# Altium schematic sheet top.SchDoc
size A
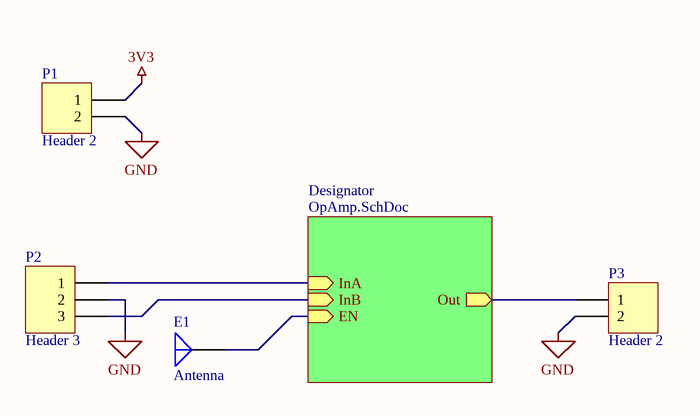
[diagram p0: top.SchDoc]

## Parts
E1  Antenna  [PIN1]
P1  Header 2  [HEADER 1X2 Male]
P2  Header 3  [HEADER 1X3 MALE]
P3  Header 2  [HEADER 1X2 Male]

## Sub-sheets
Designator = OpAmp.SchDoc: Out (out), InA (in), InB (in), EN (in)

## Nets
3V3: P1.1
GND: P1.2 P2.2 P3.2
NetE1_1: E1.1(A) ; sheet Designator/EN
NetP2_1: P2.1 ; sheet Designator/InA
NetP2_3: P2.3 ; sheet Designator/InB
NetP3_1: P3.1 ; sheet Designator/Out

## Library data of the parts
E1 = Antenna: Generic Antenna; Published: 24-Mar-1999; LatestRevisionDate: 17-Jul-2002; LatestRevisionNote: Re-released for DXP Platform.; PackageReference: PIN1; Publisher: Altium Limited
P1 P3 = Header 2: Header, 2-Pin; LatestRevisionDate: 17-Jul-2002; LatestRevisionNote: Re-released for DXP Platform.; Publisher: Altium Limited
P2 = Header 3: Header, 3-Pin; LatestRevisionDate: 17-Jul-2002; LatestRevisionNote: Re-released for DXP Platform.; Publisher: Altium Limited